# Altium schematic sheet Amphenol ICC_1.SchDoc
size A4; SheetNumber: 3; SheetTotal: 6
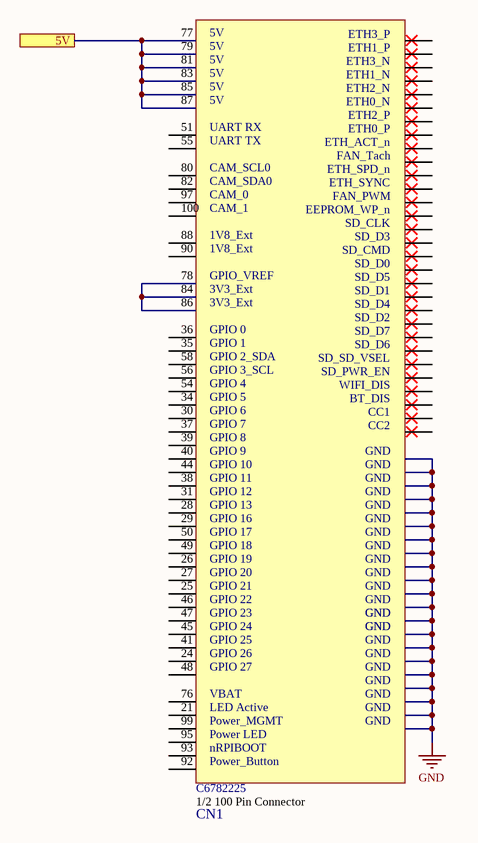
[diagram p0: Amphenol ICC_1.SchDoc]

## Parts
CN1  1/2 100 Pin Connector  [CONN-SMD_100P-P0.40_10164227-1001A1RLF]

## Ports
5V

## Nets
GND: CN1.1 CN1.2 CN1.7 CN1.8 CN1.13 CN1.14 CN1.22 CN1.23 CN1.32 CN1.33 CN1.42 CN1.43 CN1.52 CN1.53 CN1.59 CN1.60 CN1.65 CN1.66 CN1.71 CN1.74 CN1.98
5V: CN1.77 CN1.79 CN1.81 CN1.83 CN1.85 CN1.87 ; port 5V
NetCN1_78: CN1.78(GPIO_VREF) CN1.84 CN1.86

Not connected (* = marked no-connect by the designer): CN1 21 24 25 26 27 28 29 30 31 34 35 36 37 38 39 40 41 44 45 46 47 48 49 50 51 54 55 56 57 58 61 62 63 64 67 68 69 70 72 73 75 76 80 82 88 89 90 91 92 93 94 95 96 97 99 100 EEPROM(20) ETH 0N(10) ETH 1N(6) ETH 1P(4) ETH 2N(9) ETH 2P(11) ETH 3N(5) ETH 3P(3) ETH LED 2(17) ETH LED 3(15) ETH SYNC OUT(18) FAN PWM(19) FAN_Tacho(16)

## Notes on the sheet
- (in symbol 10164227-1001A1RLF) ETH3_P; 5V; ETH1_P; ETH3_N; ETH1_N; ETH2_N; ETH0_N; ETH2_P; ETH0_P; UART RX; ETH_ACT_n; UART TX; FAN_Tach; ETH_SPD_n; CAM_SCL0; ETH_SYNC; CAM_SDA0; FAN_PWM; CAM_0; EEPROM_WP_n; CAM_1; SD_CLK; SD_D3; 1V8_Ext; SD_CMD; SD_D0; SD_D5; SD_D1; 3V3_Ext; SD_D4; SD_D2; SD_D7; GPIO 0; SD_D6; GPIO 1; SD_SD_VSEL; GPIO 2_SDA; SD_PWR_EN; GPIO 3_SCL; WIFI_DIS; GPIO 4; BT_DIS; GPIO 5; CC1; GPIO 6; CC2; GPIO 7; GPIO 8; GPIO 9; GND; GPIO 10; GPIO 11; GPIO 12; GPIO 13; GPIO 16; GPIO 17; GPIO 18; GPIO 19; GPIO 20; GPIO 21; GPIO 22; GPIO 23; GPIO 24; GPIO 25; GPIO 26; GPIO 27; VBAT; LED Active; Power_MGMT; Power LED; nRPIBOOT; Power_Button; C6782225

## Library data of the parts
CN1 = 10164227-1001A1RLF: 100 Position Board to Board Connector Surface Mount,P=0.4mm Gold; Source: LCSC